# EAGLE design digital lockin (EAGLE 9.6.2)

## Sheet 1 of 2
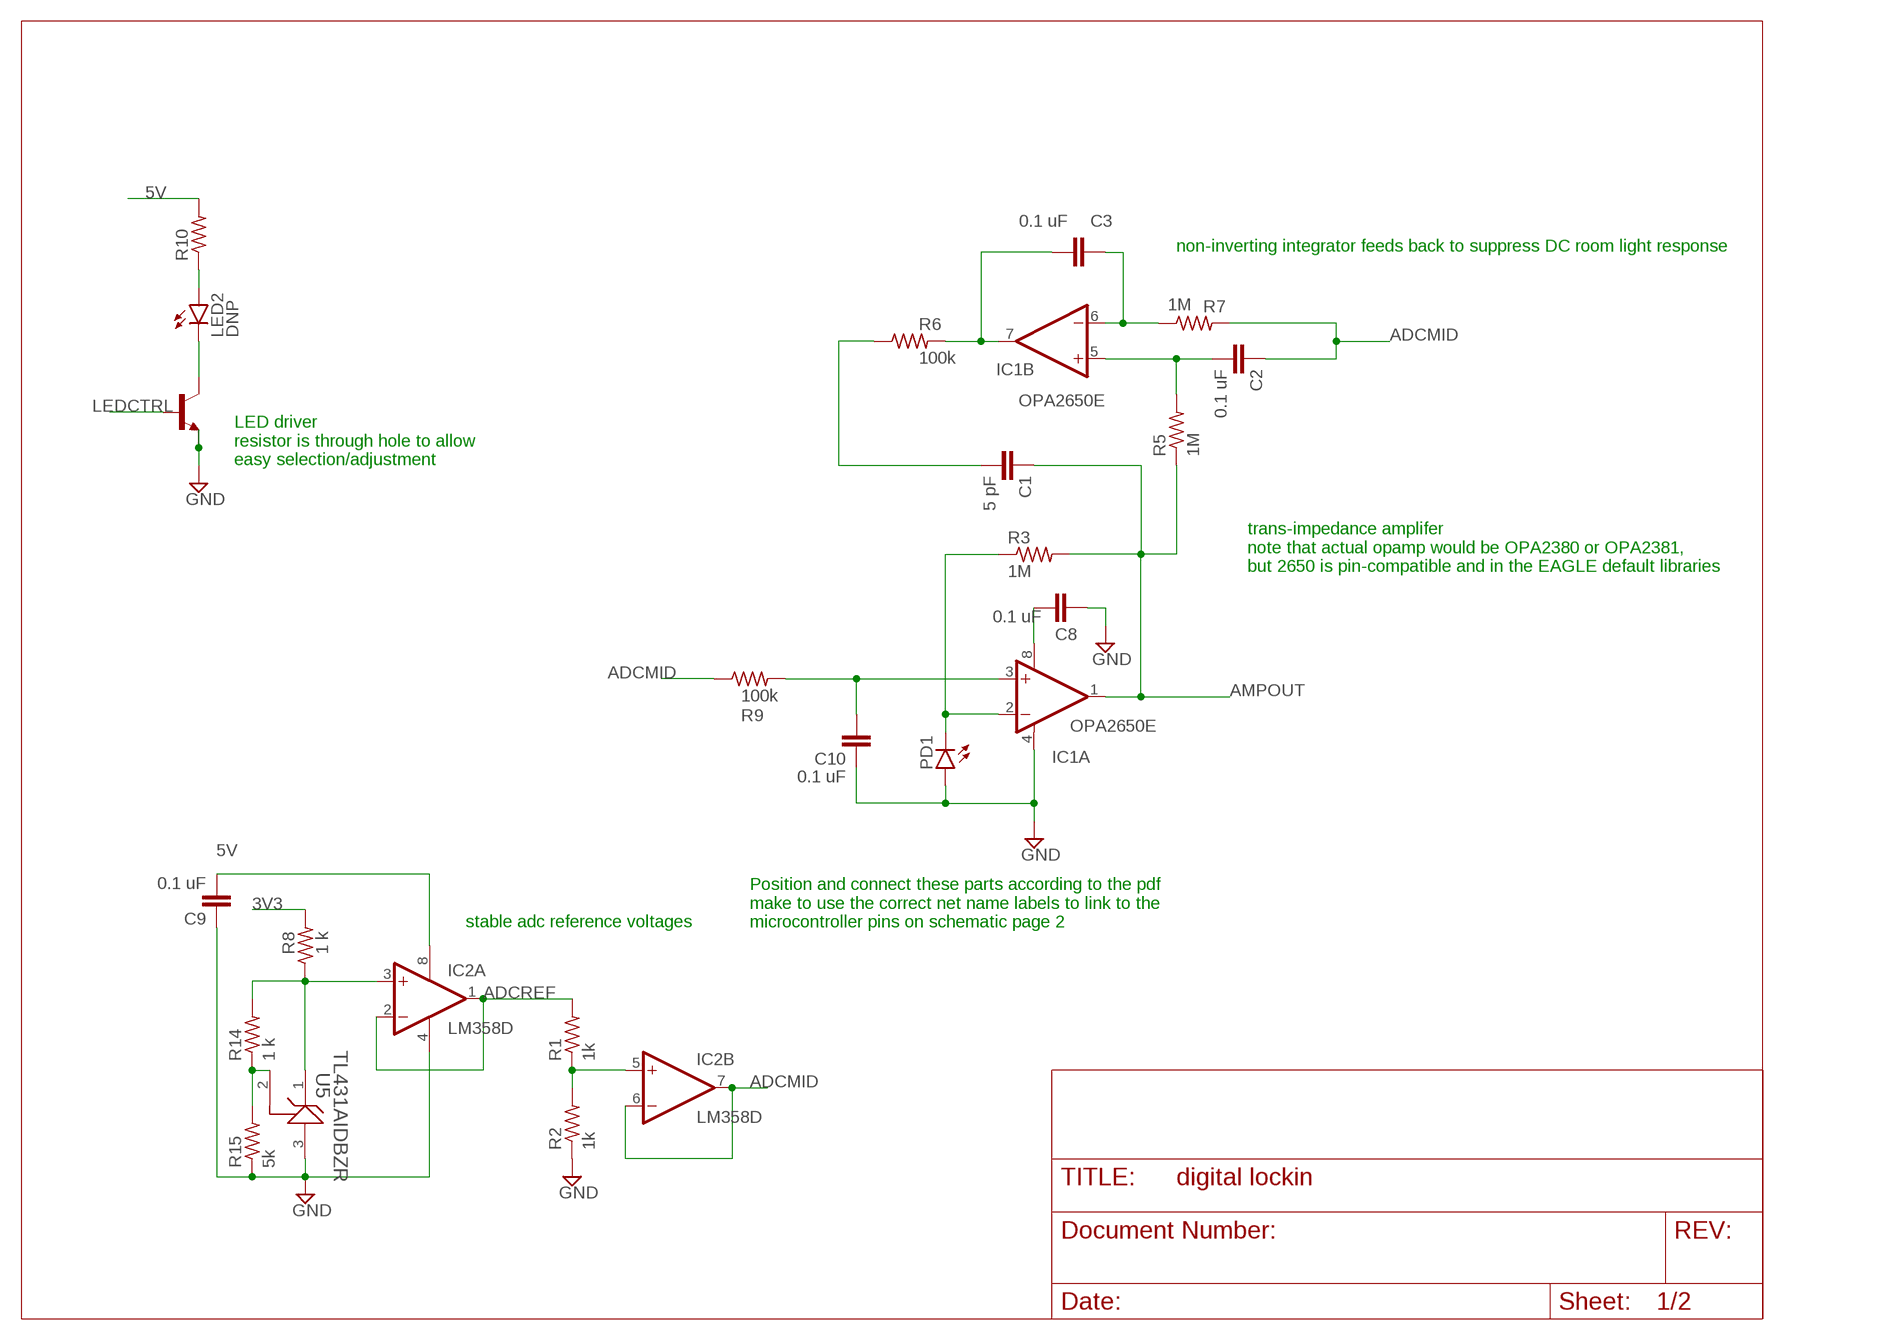
[diagram p0: schematic, sheet 1]

### Parts
C1  5 pF  C-EUC0805  [C0805]
C2  0.1 uF  C-EUC0805  [C0805]
C3  0.1 uF  C-EUC0805  [C0805]
C8  0.1 uF  C-EUC0805  [C0805]
C9  0.1 uF  C-EUC0805  [C0805]
C10  0.1 uF  C-EUC0805  [C0805]
IC1  OPA2650E  [MSOP08]
IC2  LM358D  [SO08]
LED2  DNP  LED5MM  [LED5MM]
PD1  DNP  LED5MM  [LED5MM]
R1  1k  R-US_R0805  [R0805]
R2  1k  R-US_R0805  [R0805]
R3  1M  R-US_R0805  [R0805]
R5  1M  R-US_R0805  [R0805]
R6  100k  R-US_R0805  [R0805]
R7  1M  R-US_R0805  [R0805]
R8  1 k  R-US_R0805  [R0805]
R9  100k  R-US_R0805  [R0805]
R10  DNP  R-US_0204/2V  [0204V]
R14  1 k  R-US_R0805  [R0805]
R15  5k  R-US_R0805  [R0805]
T2  NPN  BC808-NPN-SOT23-BEC  [SOT23-BEC]
U5  TL431AIDBZR  [DBZ0003A_N]

### Nets
3V3 [power]: R8.2 ; also sheet 2
5V [power]: C9.2 IC2.8(P:V+) R10.2 ; also sheet 2
ADCMID: C2.1 IC2.6(B:-IN) IC2.7(B:OUT) R7.2 R9.1 ; also sheet 2
ADCREF: IC2.1(A:OUT) IC2.2(A:-IN) R1.2 ; also sheet 2
AMPOUT: C1.1 IC1.1(A:OUT) R3.2 R5.1 ; also sheet 2
GND [power]: C8.1 C9.1 C10.1 IC1.4(A:V-) IC2.4(P:V-) PD1.A R2.1 R15.1 T2.E U5.3(ANODE) ; also sheet 2
LEDCTRL: T2.B ; also sheet 2
N$1: C3.2 IC1.7(B:OUT) R6.2
N$2: C3.1 IC1.6(B:-IN) R7.1
N$3: LED2.K(C) T2.C
N$4: C2.2 IC1.5(B:+IN) R5.2
N$6: C1.2 R6.1
N$7: IC1.2(A:-IN) PD1.K(C) R3.1
N$8: C8.2 IC1.8(A:V+)
N$9: IC2.3(A:+IN) R8.1 R14.2 U5.1(CATHODE)
N$10: IC2.5(B:+IN) R1.1 R2.2
N$12: LED2.A R10.1
N$13: C10.2 IC1.3(A:+IN) R9.2
N$20: R14.1 R15.2 U5.2(REF)

### Notes on the sheet
- non-inverting integrator feeds back to suppress DC room light response
- LED driver
  resistor is through hole to allow 
  easy selection/adjustment
- trans-impedance amplifer
  note that actual opamp would be OPA2380 or OPA2381, 
  but 2650 is pin-compatible and in the EAGLE default libraries
- stable adc reference voltages
- Position and connect these parts according to the pdf
  make to use the correct net name labels to link to the 
  microcontroller pins on schematic page 2

## Sheet 2 of 2
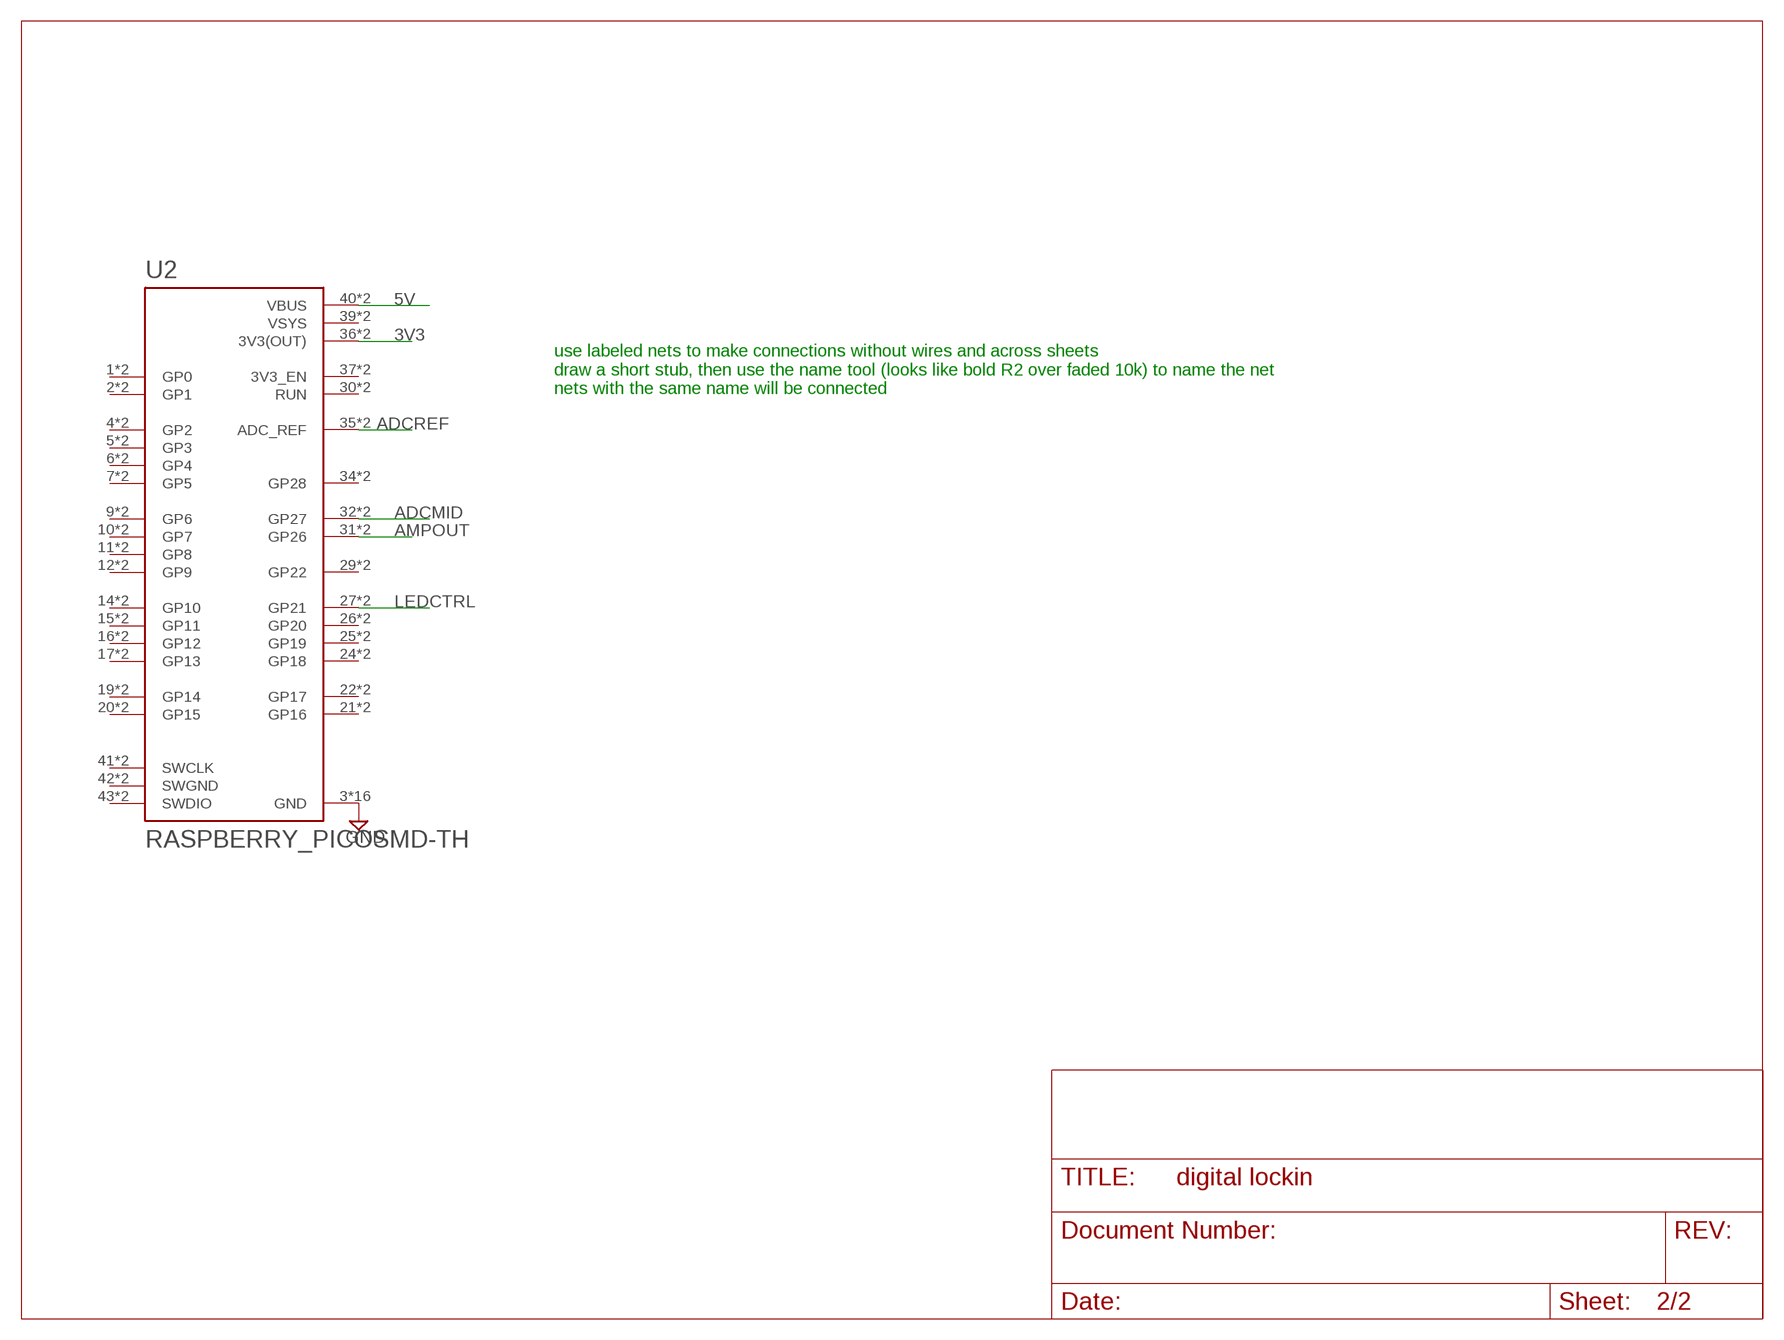
[diagram p1: schematic, sheet 2]

### Parts
U2  RASPBERRY_PICOSMD-TH  [PICO-PKG]

### Nets
3V3 [power]: U2.36(3V3(OUT)) U2.P$36(3V3(OUT)) ; also sheet 1
5V [power]: U2.40(VBUS) U2.P$40(VBUS) ; also sheet 1
ADCMID: U2.32(GP27) U2.P$32(GP27) ; also sheet 1
ADCREF: U2.35(ADC_REF) U2.P$35(ADC_REF) ; also sheet 1
AMPOUT: U2.31(GP26) U2.P$31(GP26) ; also sheet 1
GND [power]: U2.3(GND) U2.8(GND) U2.13(GND) U2.18(GND) U2.23(GND) U2.28(GND) U2.33(GND) U2.38(GND) U2.P$3(GND) U2.P$8(GND) U2.P$13(GND) U2.P$18(GND) U2.P$23(GND) U2.P$28(GND) U2.P$33(GND) U2.P$38(GND) ; also sheet 1
LEDCTRL: U2.27(GP21) U2.P$27(GP21) ; also sheet 1
Unconnected: U2.1(GP0) U2.2(GP1) U2.4(GP2) U2.5(GP3) U2.6(GP4) U2.7(GP5) U2.9(GP6) U2.10(GP7) U2.11(GP8) U2.12(GP9) U2.14(GP10) U2.15(GP11) U2.16(GP12) U2.17(GP13) U2.19(GP14) U2.20(GP15) U2.21(GP16) U2.22(GP17) U2.24(GP18) U2.25(GP19) U2.26(GP20) U2.29(GP22) U2.30(RUN) U2.34(GP28) U2.37(3V3_EN) U2.41(SWCLK) U2.43(SWDIO) U2.P$1(GP0) U2.P$2(GP1) U2.P$4(GP2) U2.P$5(GP3) U2.P$6(GP4) U2.P$7(GP5) U2.P$9(GP6) U2.P$10(GP7) U2.P$11(GP8) U2.P$12(GP9) U2.P$14(GP10) U2.P$15(GP11) U2.P$16(GP12) U2.P$17(GP13) U2.P$19(GP14) U2.P$20(GP15) U2.P$21(GP16) U2.P$22(GP17) U2.P$24(GP18) U2.P$25(GP19) U2.P$26(GP20) U2.P$29(GP22) U2.P$30(RUN) U2.P$34(GP28) U2.P$37(3V3_EN) U2.P$41(SWCLK) U2.P$43(SWDIO)

### Notes on the sheet
- use labeled nets to make connections without wires and across sheets
  draw a short stub, then use the name tool (looks like bold R2 over faded 10k) to name the net
  nets with the same name will be connected

## Power pins joined to a net without a drawn wire
SWGND: U2.42(SWGND) U2.P$42(SWGND)
VSYS: U2.39(VSYS) U2.P$39(VSYS)

## Library data of the parts
C1 = rcl:C-EU: CAPACITOR, European symbol; SPICEPREFIX: C
C2 C3 C8-C10 = rcl:C-EU: CAPACITOR, European symbol; LCSC_PART#: C28233; SPICEPREFIX: C
IC1 = burr-brown:OPA2650: Dual Wideband, Low Power Voltage Feedback Operational Amplifier; ACTUAL_PART: OPA2381; LCSC_PART#: C181662; OC_FARNELL: unknown; OC_NEWARK: unknown
IC2 = linear:LM358: OP AMP also LM158; LM258; LM2904 Source: http://cache.national.com/ds/LM/LM158.pdf; LCSC_PART#: C7950
LED2 PD1 = led:LED: LED OSRAM: - CHIPLED LG R971, LG N971, LY N971, LG Q971, LY Q971, LO R971, LY R971 LH N974, LH R974 LS Q976, LO Q976, LY Q976 LO Q996 - Hyper CHIPLED LW Q18S LB Q993, LB Q99A, LB R99A - SideLED LS A670, LO A670, LY A670, LG A670, LP A670 LB A673, LV A673, LT A673, LW A673 LH A674 LY A675 LS A676, LA A676, LO A676, LY A676, LW A676 LS A679, LY A679, LG A679 - Hyper Micro SIDELED® LS Y876, LA Y876, LO Y876, LY Y876 LT Y87S - SmartLED LW L88C, LW L88S LB L89C, LB L89S, LG L890 LS L89K, LO L89K, LY L89K LS L896, LA L896, LO L896, LY L896 - TOPLED LS T670, LO T670, LY T670, LG T670, LP T670 LSG T670, LSP T670, LSY T670, LOP T670, LYG T670 LG T671, LOG T671, LSG T671 LB T673, LV T673, LT T673, LW T673 LH T674 LS T676, LA T676, LO T676, LY T676, LB T676, LH T676, LSB T676, LW T676 LB T67C, LV T67C, LT T67C, LS T67K, LO T67K, LY T67K, LW E67C LS E67B, LA E67B, LO E67B, LY E67B, LB E67C, LV E67C, LT E67C LW T67C LS T679, LY T679, LG T679 LS T770, LO T770, LY T770, LG T770, LP T770 LB T773, LV T773, LT T773, LW T773 LH T774 LS E675, LA E675, LY E675, LS T675 LS T776, LA T776, LO T776, LY T776, LB T776 LHGB T686 LT T68C, LB T68C - Hyper Mini TOPLED® LB M676 - Mini TOPLED Santana® LG M470 LS M47K, LO M47K, LY M47K Source: http://www.osram.convergy.de LUXEON: - LUMILED® LXK2-PW12-R00, LXK2-PW12-S00, LXK2-PW14-U00, LXK2-PW14-V00 LXK2-PM12-R00, LXK2-PM12-S00, LXK2-PM14-U00 LXK2-PE12-Q00, LXK2-PE12-R00, LXK2-PE12-S00, LXK2-PE14-T00, LXK2-PE14-U00 LXK2-PB12-K00, LXK2-PB12-L00, LXK2-PB12-M00, LXK2-PB14-N00, LXK2-PB14-P00, LXK2-PB14-Q00 LXK2-PR12-L00, LXK2-PR12-M00, LXK2-PR14-Q00, LXK2-PR14-R00 LXK2-PD12-Q00, LXK2-PD12-R00, LXK2-PD12-S00 LXK2-PH12-R00, LXK2-PH12-S00 LXK2-PL12-P00, LXK2-PL12-Q00, LXK2-PL12-R00 Source: www.luxeon.com KINGBRIGHT: KA-3528ASYC Source: www.kingbright.com
R1 R2 R8 R14 = rcl:R-US_: RESISTOR, American symbol; LCSC_PART#: C17513; SPICEPREFIX: R
R3 R5 R7 = rcl:R-US_: RESISTOR, American symbol; LCSC_PART#: C17514; SPICEPREFIX: R
R6 R9 = rcl:R-US_: RESISTOR, American symbol; LCSC_PART#: C149504; SPICEPREFIX: R
R10 R15 = rcl:R-US_: RESISTOR, American symbol; SPICEPREFIX: R
T2 = transistor:*-NPN-: NPN Transistror BF959 corrected 2008.03.06; LCSC_PART#: C2145
U2 = RpiPico:RASPBERRY_PICO: Raspberry Pi Pico
U5 = tl431:TL431AIDBZR; COPYRIGHT: Copyright (C) 2025 Ultra Librarian. All rights reserved.; LCSC_PART#: C3113; MANUFACTURER_PART_NUMBER: TL431AIDBZR; MFR_NAME: Texas Instruments; REFDES: RefDes; TYPE: TYPE

## Net classes
1 power: width 0.305 mm

## Board
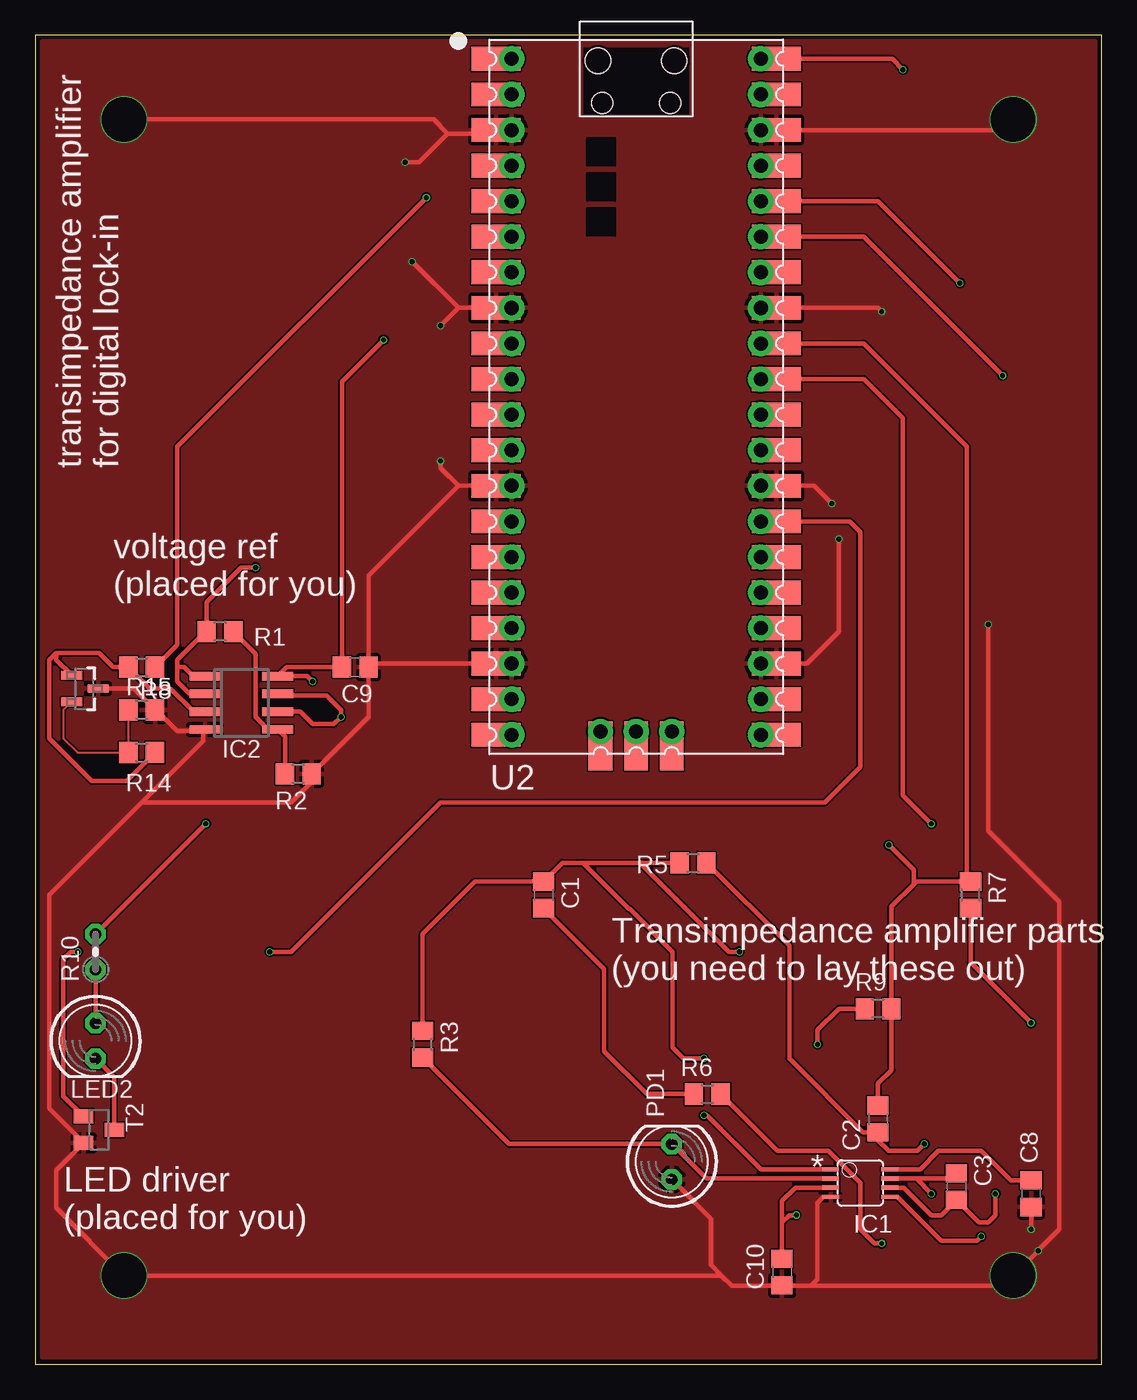
[diagram p2: board, top side]
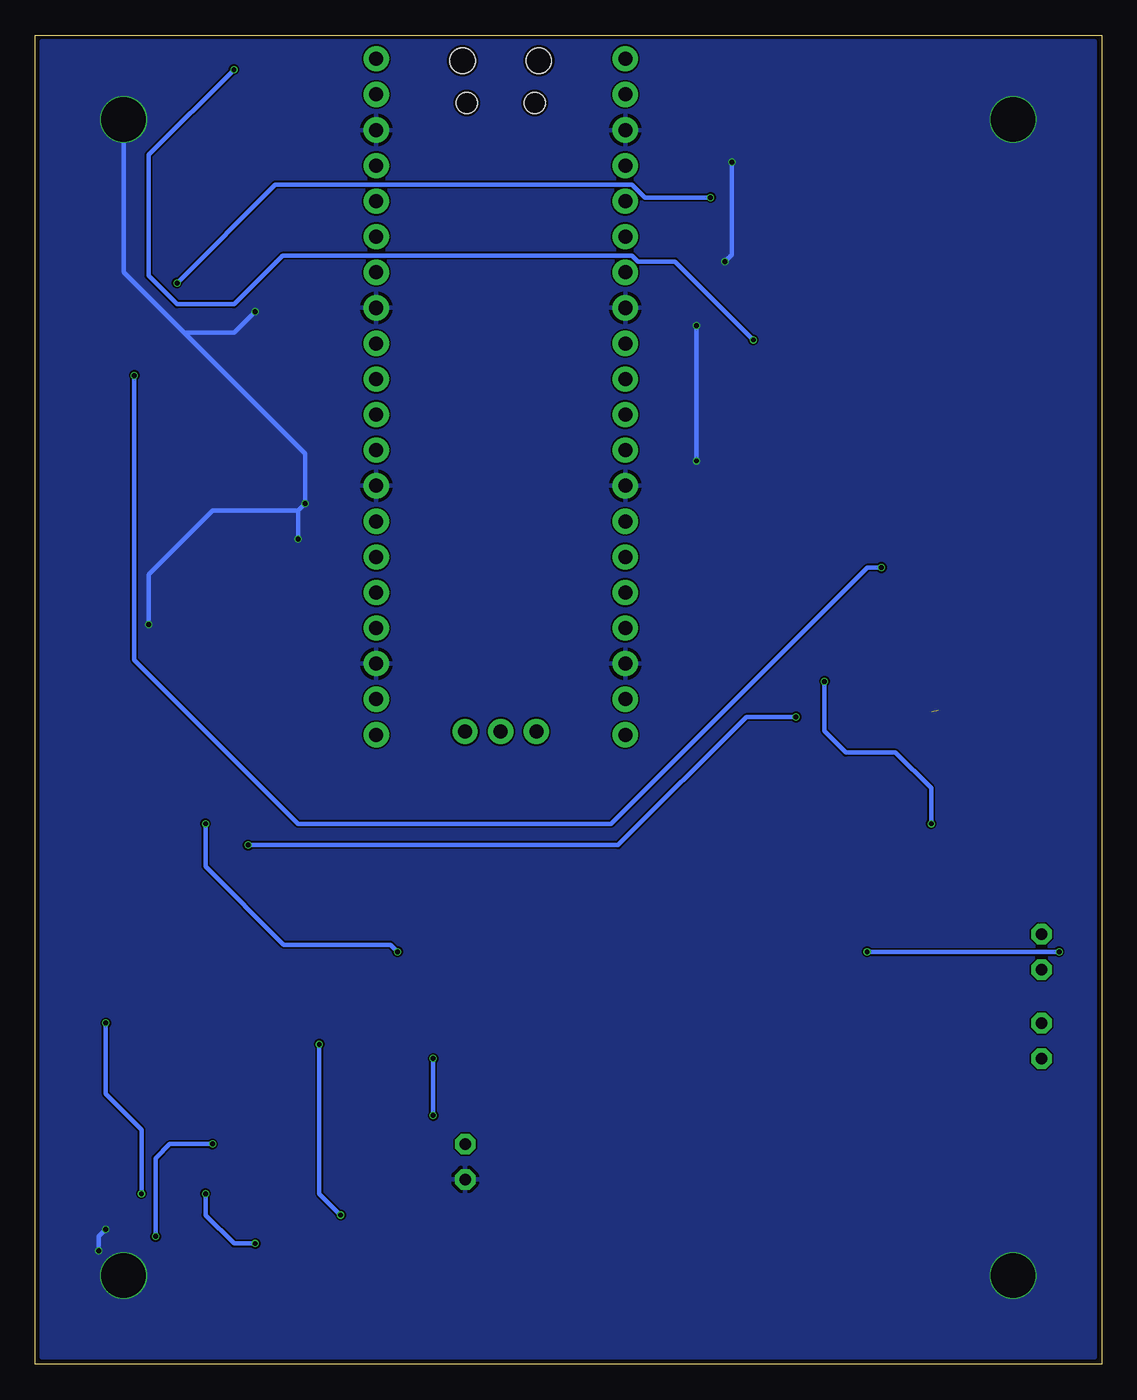
[diagram p3: board, bottom side, seen from below]

Size 76.18 x 94.92 mm. Coordinates in mm from the lower left corner, seen from the top.
Outline: 0,0 76.18,0 76.18,94.92 0,94.92 0,0
Copper layers (1*16): Top 0.035mm / dielectric 1.6mm / Bottom 0.035mm
Design rules "jlcpcb-2layers": minimum track width 5mil, minimum drill 0.3mm, track to track 5mil, track to pad 5mil, pad to pad 5mil, via to via 5mil, smd to smd 5mil, copper to edge 0.2mm, drill to drill 6mil, minimum pad ring 10mil, minimum via ring 3mil, stop-mask expansion 4mil, vias tented up to drill 0mil, thermal gap 10mil

### Footprints (pad centres in the part's own frame; a part is rotated, then mirrored left to right if it is on the bottom)
C0805 = smd 1.3 x 1.5: 1 -0.95,0; 2 0.95,0
MSOP08 = smd 0.3 x 1.2: 1 -0.976,-2.113; 2 -0.326,-2.113; 3 0.324,-2.113; 4 0.974,-2.113; 5 0.974,2.112; 6 0.324,2.112; 7 -0.326,2.112; 8 -0.976,2.112
SO08 = smd 0.6 x 2.2: 1 -1.905,-2.6; 2 -0.635,-2.6; 3 0.635,-2.6; 4 1.905,-2.6; 5 1.905,2.6; 6 0.635,2.6; 7 -0.635,2.6; 8 -1.905,2.6
LED5MM = drill 0.813 octagon: A -1.27,0; K 1.27,0
R0805 = smd 1.3 x 1.5: 1 -0.95,0; 2 0.95,0
0204V = drill 0.813 octagon: 1 -1.27,0; 2 1.27,0
SOT23-BEC = smd 1 x 1.4: B -0.95,-1.1; C 0,1.1; E 0.95,-1.1
PICO-PKG = drill 1: 1 -8.89,24.13; 2 -8.89,21.59; 3 -8.89,19.05; 4 -8.89,16.51; 5 -8.89,13.97; 6 -8.89,11.43; 7 -8.89,8.89; 8 -8.89,6.35; 9 -8.89,3.81; 10 -8.89,1.27; 11 -8.89,-1.27; 12 -8.89,-3.81; 13 -8.89,-6.35; 14 -8.89,-8.89; 15 -8.89,-11.43; 16 -8.89,-13.97; 17 -8.89,-16.51; 18 -8.89,-19.05; 19 -8.89,-21.59; 20 -8.89,-24.13; 21 8.89,-24.13; 22 8.89,-21.59; 23 8.89,-19.05; 24 8.89,-16.51; 25 8.89,-13.97; 26 8.89,-11.43; 27 8.89,-8.89; 28 8.89,-6.35; 29 8.89,-3.81; 30 8.89,-1.27; 31 8.89,1.27; 32 8.89,3.81; 33 8.89,6.35; 34 8.89,8.89; 35 8.89,11.43; 36 8.89,13.97; 37 8.89,16.51; 38 8.89,19.05; 39 8.89,21.59; 40 8.89,24.13; 41 -2.54,-23.9; 42 0,-23.9; 43 2.54,-23.9 | smd 3.5 x 1.7: P$1 -10,24.13; P$2 -10,21.59; P$3 -10,19.05; P$4 -10,16.51; P$5 -10,13.97; P$6 -10,11.43; P$7 -10,8.89; P$8 -10,6.35; P$9 -10,3.81; P$10 -10,1.27; P$11 -10,-1.27; P$12 -10,-3.81; P$13 -10,-6.35; P$14 -10,-8.89; P$15 -10,-11.43; P$16 -10,-13.97; P$17 -10,-16.51; P$18 -10,-19.05; P$19 -10,-21.59; P$20 -10,-24.13; P$21 10,-24.13; P$22 10,-21.59; P$23 10,-19.05; P$24 10,-16.51; P$25 10,-13.97; P$26 10,-11.43; P$27 10,-8.89; P$28 10,-6.35; P$29 10,-3.81; P$30 10,-1.27; P$31 10,1.27; P$32 10,3.81; P$33 10,6.35; P$34 10,8.89; P$35 10,11.43; P$36 10,13.97; P$37 10,16.51; P$38 10,19.05; P$39 10,21.59; P$40 10,24.13 | smd 1.7 x 3.5: P$41 -2.54,-24.925; P$42 0,-24.925; P$43 2.54,-24.925 | hole 1.8: -2.725,24; 2.725,24 | hole 1.5: -2.425,20.97; 2.425,20.97
DBZ0003A_N = smd 1.5 x 0.6: 1 0.95,-0.95; 2 0.95,0.95; 3 -0.95,0

### Placement (x,y rotation side)
C1  36.32,33.53 270 top
C2  60.2,17.53 270 top
C3  65.79,12.7 90 top
C8  71.12,12.19 90 top
C9  22.86,49.78 180 top
C10  53.34,6.6 90 top
IC1  58.93,12.95 270 top
IC2  14.73,47.24 270 top
LED2  4.32,23.11 270 top
PD1  45.47,14.48 90 top
R1  13.21,52.32 180 top
R2  18.8,42.16 180 top
R3  27.69,22.86 90 top
R5  46.99,35.81 0 top
R6  48.01,19.3 0 top
R7  66.8,33.53 90 top
R8  7.62,49.78 0 top
R9  60.2,25.4 180 top
R10  4.32,29.46 90 top
R14  7.62,43.69 0 top
R15  7.62,46.74 180 top
T2  4.57,16.76 270 top
U2  42.93,69.09 0 top
U5  3.56,48.26 180 top

### Tracks (layer width: path | path; a pad name or v marks a point on that pad's centre or on a via)
3V3  (via drill 0.35)
  Top 0.305: R8.2 10.16,51.37 10.16,65.53 v27.94,83.31 | v66.04,77.22 60.2,83.06 U2.P$36 U2.36
  Bottom 0.305: v27.94,83.31 32.62,83.31 33.55,84.24 59.02,84.24 v66.04,77.22
5V  (via drill 0.35)
  Top 0.305: R10.2 v12.19,38.61 | v19.81,48.77 19.43,49.15 IC2.8 17.97,49.78 C9.2 21.91,70.17 v24.89,73.15 | U2.P$40 61.21,93.22 v61.98,92.46
  Bottom 0.305: v12.19,38.61 12.19,41.15 14.73,43.69 18.29,43.69 19.81,45.21 v19.81,48.77 | v24.89,73.15 30.48,78.74 33.13,78.74 33.55,79.16 58.51,79.16 61.98,75.69 66.04,75.69 68.07,77.72 68.07,86.36 v61.98,92.46
ADCMID  (via drill 0.35)
  Top 0.305: IC2.7 17.46,47.75 20.83,47.75 21.84,46.74 v21.84,46.23 21.34,45.72 19.81,45.72 18.92,46.61 IC2.6 | U2.P$32 59.18,72.9 66.55,65.53 66.55,34.73 R7.2 62.93,34.48 62.74,34.29 | 62.74,34.29 61.15,32.7 R9.1 61.15,21.02 60.2,20.07 C2.1 | 62.74,34.29 62.74,35.31 v60.96,37.08
  Bottom 0.305: v21.84,46.23 25.4,46.23 34.54,37.08 v60.96,37.08
ADCREF  (via drill 0.35)
  Top 0.305: IC2.2 11.05,47.88 10.16,48.77 10.16,49.78 | 10.16,49.78 10.16,50.29 12.19,52.32 R1.2 12.26,54.42 14.73,56.9 v15.75,56.9 | 10.16,49.78 10.67,49.78 11.3,49.15 IC2.1 | U2.P$35 59.18,80.52 v69.09,70.61
  Bottom 0.305: v15.75,56.9 16.76,56.9 35.05,38.61 57.4,38.61 69.09,50.29 v69.09,70.61
AMPOUT  (via drill 0.35)
  Top 0.305: R3.2 27.69,30.73 31.43,34.48 C1.1 37.66,35.81 39.12,35.81 | 39.12,35.81 43.18,35.81 | 43.18,35.81 R5.1 | IC1.1 51.82,13.93 47.97,17.78 v47.75,17.78 | U2.P$31 59.18,70.36 61.98,67.56 61.98,40.64 v64.01,38.61 | 39.12,35.81 42.42,32.51 42.48,32.51 45.53,29.46 45.53,22.62 46.31,21.84 v47.75,21.84 | 43.18,35.81 49.53,29.46 v50.29,29.46
  Bottom 0.305: v47.75,17.78 v47.75,21.84 | v50.29,29.46 50.8,29.97 58.42,29.97 64.01,35.56 v64.01,38.61
GND  (via drill 0.35, 3.17)
  Top 0.305: C9.1 24.06,50.04 U2.18 U2.P$18 | C9.1 23.81,46.23 R2.1 19.75,41.59 18.29,40.13 7.62,40.13 | v6.35,88.9 28.45,88.9 29.46,87.88 | 29.46,87.88 33.78,87.88 33.91,88.01 | 33.91,88.01 U2.3 | U2.38 52.07,87.88 52.67,87.88 U2.P$38 69.09,88.14 v69.85,88.9 | U5.3 7.05,48.26 R15.1 8.64,46.74 10.16,45.21 12.01,45.21 | 7.62,40.13 1.02,33.53 1.02,18.27 T2.E 1.52,13.87 1.52,11.18 v6.35,6.35 49.02,6.35 | 12.01,45.21 IC2.4 | 53.37,5.62 C10.1 | PD1.A 48.26,10.41 48.26,7.11 49.02,6.35 | 53.37,5.62 49.75,5.62 49.02,6.35 | IC1.4 56.31,11.98 55.88,11.55 55.88,6.1 55.41,5.62 | 53.37,5.62 55.41,5.62 | 55.41,5.62 69.12,5.62 v69.85,6.35 | v71.63,8.13 v69.85,6.35 | C8.1 v71.12,9.65 | v57.4,58.93 57.4,52.32 55.12,50.04 U2.P$23 U2.23 | v56.9,61.47 55.63,62.74 U2.P$28 U2.28 | 30.23,75.44 U2.P$8 U2.8 | 30.23,75.44 v28.96,74.17 | 30.23,62.74 U2.P$13 U2.13 | v28.96,64.52 28.96,64.01 30.23,62.74 | 30.23,75.44 v26.92,78.74 | v26.42,85.85 27.43,85.85 29.46,87.88 | v60.45,75.18 60.2,75.44 U2.P$33 U2.33 | 30.23,62.74 23.81,56.32 C9.1 | 12.01,45.21 12.01,44.52 7.62,40.13 | v69.85,6.35 73.15,9.65 73.15,33.02 68.07,38.1 v68.07,52.83 | U2.P$3 33.05,88.01 33.91,88.01
  Bottom 0.305: v71.12,9.65 71.63,9.14 v71.63,8.13 | v57.4,58.93 57.4,60.96 | 57.4,60.96 v56.9,61.47 56.9,65.02 65.53,73.66 | v69.85,88.9 69.85,77.98 65.53,73.66 | v28.96,74.17 v28.96,64.52 | v26.92,78.74 26.42,79.25 v26.42,85.85 | 65.53,73.66 61.98,73.66 v60.45,75.18 | 57.4,60.96 63.5,60.96 68.07,56.39 v68.07,52.83
  pour Top: 0.51,94.49 75.69,94.49 75.69,0.51 0.51,0.51
  pour Bottom: 0.51,94.49 75.69,94.49 75.69,0.51 0.51,0.51
LEDCTRL  (via drill 0.35)
  Top 0.305: T2.B 2.03,19.15 2.03,28.96 2.54,29.46 v3.05,29.46 | v16.76,29.46 18.29,29.46 28.96,40.13 56.39,40.13 58.93,42.67 58.93,59.44 58.17,60.2 U2.P$27
  Bottom 0.305: v16.76,29.46 v3.05,29.46
N$1  (via drill 0.35)
  Top 0.305: R6.2 53.02,15.24 56.65,15.24 58.93,12.96 58.93,9.65 59.94,8.64 v60.45,8.64 | IC1.7 62.92,13.28 | 62.92,13.28 v64.01,12.19 | C3.2 65.42,13.28 62.92,13.28
  Bottom 0.305: v64.01,12.19 64.01,10.67 61.98,8.64 v60.45,8.64
N$2  (via drill 0.35)
  Top 0.305: IC1.6 62.05,12.63 64.01,10.67 64.7,10.67 C3.1 67.38,10.16 68.07,10.16 68.58,10.67 v68.58,12.19 | v71.12,24.38 66.8,28.7 R7.1
  Bottom 0.305: v68.58,12.19 68.58,16.76 71.12,19.3 v71.12,24.38
N$3
  Top 0.305: T2.C 5.67,20.49 LED2.K
N$4  (via drill 0.35)
  Top 0.152: 61.47,11.98 IC1.5
  Top 0.305: R5.2 53.85,29.91 53.85,21.84 59.12,16.58 C2.2 60.2,16 60.96,15.24 62.99,15.24 v63.5,15.75 | 61.47,11.98 61.58,11.98 64.72,8.84 67.26,8.84 v67.56,9.14
  Bottom 0.305: v67.56,9.14 67.56,14.73 66.55,15.75 v63.5,15.75
N$6
  Top 0.305: C1.2 40.64,28.26 40.64,22.35 43.69,19.3 R6.1
N$7
  Top 0.305: IC1.2 47.93,13.28 PD1.K 33.85,15.75 R3.1
N$8
  Top 0.305: IC1.8 63.21,13.93 64.52,15.24 67.56,15.24 69.66,13.14 C8.2
N$9  (1 unrouted)
  Top 0.305: 1.52,50.8 4.57,50.8 5.59,49.78 R8.1 8.18,48.27 9.65,48.27 11.32,46.61 IC2.3 | 1.52,50.8 1.52,50.29 U5.1 | 11.68,46.74 11.58,46.63 | R14.2 6.54,41.66 4.06,41.66 1.02,44.7 1.02,50.29 1.52,50.8
N$10
  Top 0.305: R2.2 17.85,44.77 17.85,44.83 IC2.5 16.64,45.34 15.75,46.23 15.75,50.73 R1.1
N$12
  Top 0.305: R10.1 LED2.A
N$13  (via drill 0.35)
  Top 0.305: C10.2 53.34,10.16 | 53.34,10.16 53.34,11.68 54.29,12.63 IC1.3 | R9.2 57.4,25.4 55.88,23.88 v55.88,22.86 | 53.34,10.16 53.85,10.67 v54.36,10.67
  Bottom 0.305: v55.88,22.86 55.88,12.19 v54.36,10.67
N$20
  Top 0.152: R15.2 R14.1 3.05,43.69 2.03,44.7 2.03,46.74 U5.2

### Text on the board
tPlace: TIPS: / turn off the ground airwires / command: ratsnest ! GND / "untangle" the remaining airwires as best you can / (see voltage ref for an example) / pour a ground plane on both sides / (use polygon on top layer(1) and then polygon on bottom layer (16) , type GND for the net name) / then use ripup/visible polygons so you can see what you're doing again / Tools->Autorouter will attempt to route the board automatically / If you do by hand, make one layer horizontal (e.g. top) wires / and one layer (e.g. bottom) vertical wires. / Use the middle mouse button to switch layers while drawing and insert a via automatically / At power supply GND and bypass capacitor grounds, try to make a short stub and then add a via (middle mouse button) / then hit esc to end on the via / this will make a connection to the ground plane on both sides of the board / After you autoroute, type ratsnest to fill the polygons and run a DRC to check for airwires. / Usually these are on the ground plane. / Add vias to ground (see above) where needed and on power supply pins/bypass caps | voltage ref / (placed for you) | Transimpedance amplifier parts / (you need to lay these out) | LED driver / (placed for you) | I have already done this, but to make the autorouter draw thick power wires (so they can carry current), use edit->net classes / to set the power nets and then rules to say a minimum width (here 12)
tNames: transimpedance amplifier / for digital lock-in | *